# Altium schematic sheet Connector B.SchDoc
size A4; SheetNumber: 13; SheetTotal: 16
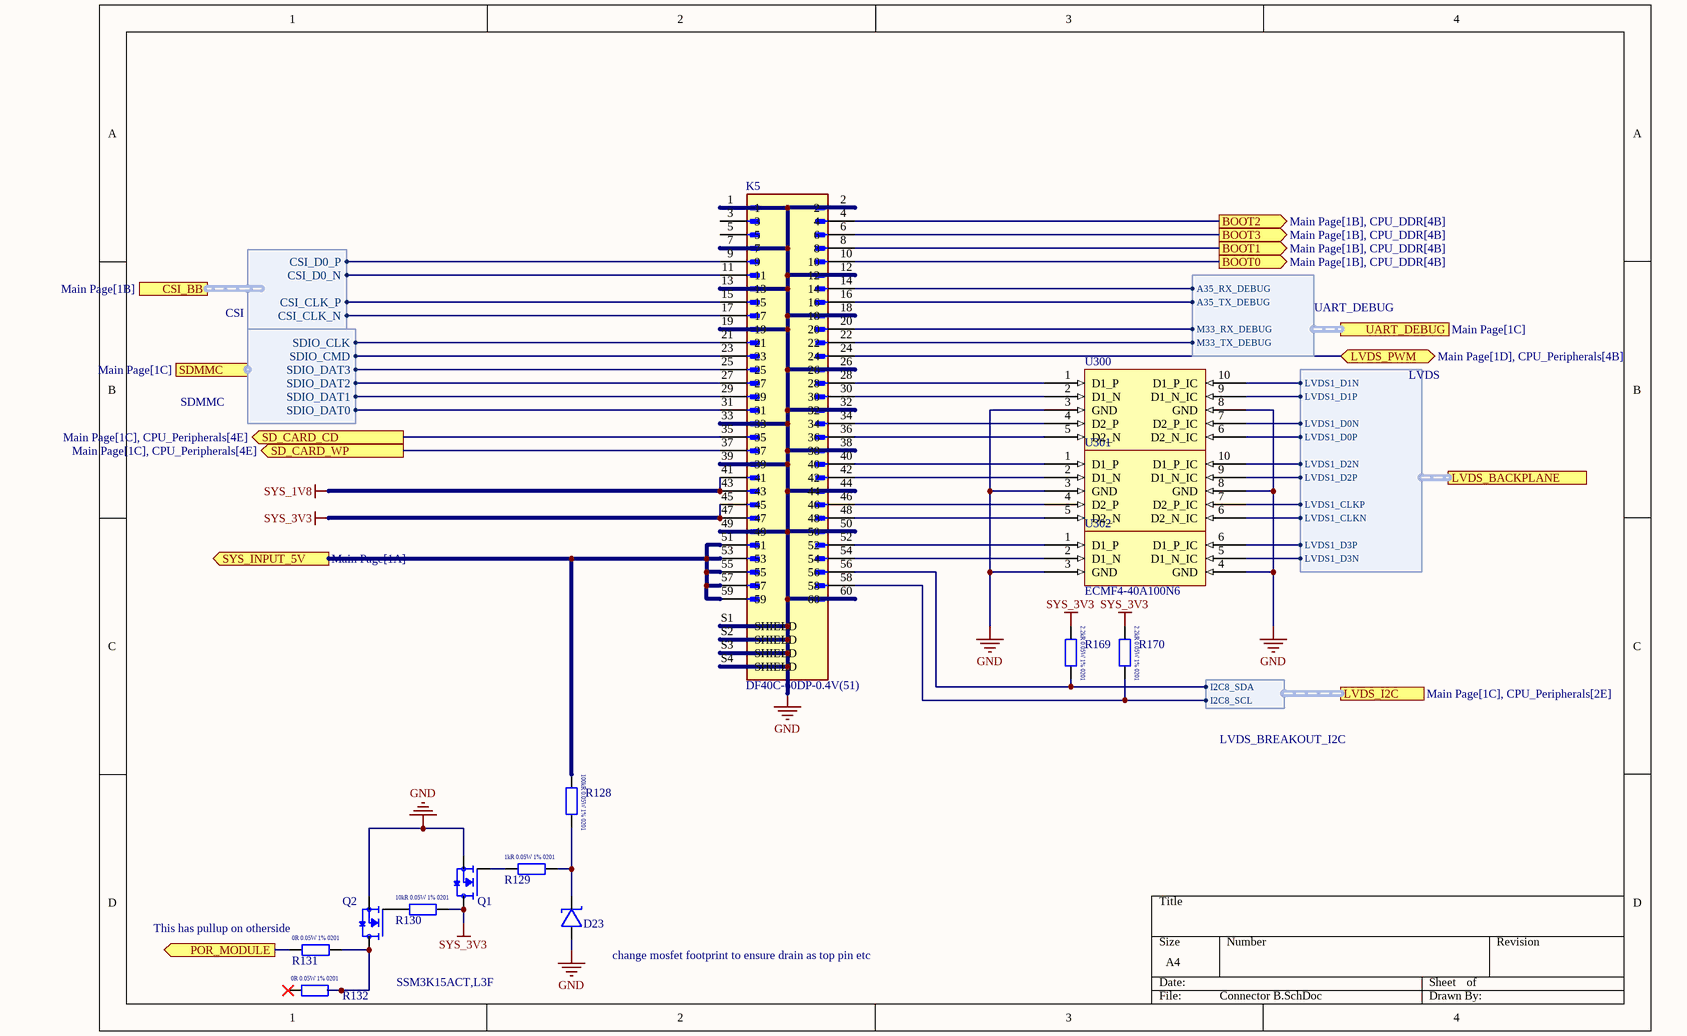
[diagram p0: Connector B.SchDoc]

## Parts
D23  RCLAMP04041PW.C  [RCLAMP04041PW.C]  (value not drawn)
K5  DF40C-60DP-0.4V(51)  [HIROSE_DF40C-60DP-0.4V(51)]
Q1  SSM3K15ACT,L3F  [SSM3K15ACT]
Q2  SSM3K15ACT,L3F  [SSM3K15ACT]  (value not drawn)
R128  ERJ-1GNF1003C  [RESC0603X03L]  (value not drawn)
R129  ERJ-1GNF1001C  [RESC0603X03L]  (value not drawn)
R130  ERJ-1GNF1002C  [RESC0603X03L]  (value not drawn)
R131  ERJ-1GN0R00C  [RESC0603X03L]  (value not drawn)
R132  ERJ-1GN0R00C  [RESC0603X03L]  (value not drawn)
R169  RC0201FR-072K2L  [RESC0603X03L]  (value not drawn)
R170  RC0201FR-072K2L  [RESC0603X03L]  (value not drawn)
U300  ECMF4-40A100N10  [ECMF4-40A100N10]
U301  ECMF4-40A100N10  [ECMF4-40A100N10]
U302  ECMF4-40A100N6  [ECMF2-40A100N6]

## Ports
BOOT0 (out, see Main Page[1B], CPU_DDR[4B]), BOOT1 (out, see Main Page[1B], CPU_DDR[4B]), BOOT2 (out, see Main Page[1B], CPU_DDR[4B]), BOOT3 (out, see Main Page[1B], CPU_DDR[4B]), CSI_BB (harness CSI, see Main Page[1B]), LVDS_BACKPLANE (harness LVDS, see Main Page[1A]), LVDS_I2C (harness LVDS_BREAKOUT_I2C, see Main Page[1C], CPU_Peripherals[2E]), LVDS_PWM (bidir, see Main Page[1D], CPU_Peripherals[4B]), POR_MODULE (out, see Main Page[1A], CPU_DDR[4B], Power Management[3F]), SD_CARD_CD (out, see Main Page[1C], CPU_Peripherals[4E]), SD_CARD_WP (out, see Main Page[1C], CPU_Peripherals[4E]), SDMMC (harness SDMMC, see Main Page[1C]), SYS_INPUT_5V (out, see Main Page[1A]), UART_DEBUG (harness UART_DEBUG, see Main Page[1C])

## Harnesses
SDMMC: SDIO_CLK, SDIO_CMD, SDIO_DAT0, SDIO_DAT1, SDIO_DAT2, SDIO_DAT3
UART_DEBUG: A35_RX_DEBUG, A35_TX_DEBUG, M33_RX_DEBUG, M33_TX_DEBUG
LVDS: LVDS1_CLKN, LVDS1_CLKP, LVDS1_D0N, LVDS1_D0P, LVDS1_D1N, LVDS1_D1P, LVDS1_D2N, LVDS1_D2P, LVDS1_D3N, LVDS1_D3P
LVDS_BREAKOUT_I2C: I2C8_SCL, I2C8_SDA
CSI: CSI_CLK_N, CSI_CLK_P, CSI_D0_N, CSI_D0_P

## Nets
GND: D23.1 K5.1 K5.2 K5.7 K5.12 K5.13 K5.18 K5.19 K5.26 K5.32 K5.33 K5.38 K5.39 K5.44 K5.49 K5.50 K5.60 K5.S1(SHIELD) K5.S2(SHIELD) K5.S3(SHIELD) K5.S4(SHIELD) Q1.3(S) Q2.3(S) U300.3(GND) U300.8(GND) U301.3(GND) U301.8(GND) U302.3(GND) U302.4(GND)
SYS_1V8: K5.41 K5.43
SYS_3V3: K5.45 K5.47 Q1.2(D) R130.2 R169.1 R170.1
BOOT0: K5.10 ; port BOOT0
BOOT1: K5.8 ; port BOOT1
BOOT2: K5.4 ; port BOOT2
BOOT3: K5.6 ; port BOOT3
LVDS_PWM: K5.24 ; port LVDS_PWM
POR_MODULE: R131.1 ; port POR_MODULE
SD_CARD_CD: K5.35 ; port SD_CARD_CD
SD_CARD_WP: K5.37 ; port SD_CARD_WP
SYS_INPUT_5V: K5.51 K5.53 K5.55 K5.57 K5.59 R128.1 ; port SYS_INPUT_5V
NetD23_2: D23.2 R128.2 R129.2
NetK5_9: K5.9 ; port CSI_BB.CSI_D0_P
NetK5_11: K5.11 ; port CSI_BB.CSI_D0_N
NetK5_14: K5.14 ; port UART_DEBUG.A35_RX_DEBUG
NetK5_15: K5.15 ; port CSI_BB.CSI_CLK_P
NetK5_16: K5.16 ; port UART_DEBUG.A35_TX_DEBUG
NetK5_17: K5.17 ; port CSI_BB.CSI_CLK_N
NetK5_20: K5.20 ; port UART_DEBUG.M33_RX_DEBUG
NetK5_21: K5.21 ; port SDMMC.SDIO_CLK
NetK5_22: K5.22 ; port UART_DEBUG.M33_TX_DEBUG
NetK5_23: K5.23 ; port SDMMC.SDIO_CMD
NetK5_25: K5.25 ; port SDMMC.SDIO_DAT3
NetK5_27: K5.27 ; port SDMMC.SDIO_DAT2
NetK5_28: K5.28 U300.1(D1_P)
NetK5_29: K5.29 ; port SDMMC.SDIO_DAT1
NetK5_30: K5.30 U300.2(D1_N)
NetK5_31: K5.31 ; port SDMMC.SDIO_DAT0
NetK5_34: K5.34 U300.4(D2_P)
NetK5_36: K5.36 U300.5(D2_N)
NetK5_40: K5.40 U301.1(D1_P)
NetK5_42: K5.42 U301.2(D1_N)
NetK5_46: K5.46 U301.4(D2_P)
NetK5_48: K5.48 U301.5(D2_N)
NetK5_52: K5.52 U302.1(D1_P)
NetK5_54: K5.54 U302.2(D1_N)
NetK5_56: K5.56 R169.2 ; port LVDS_I2C.I2C8_SDA
NetK5_58: K5.58 R170.2 ; port LVDS_I2C.I2C8_SCL
NetQ1_1: Q1.1(G) R129.1
NetQ2_1: Q2.1(G) R130.1
NetQ2_2: Q2.2(D) R131.2 R132.2
NetU300_6: U300.6(D2_N_IC) ; port LVDS_BACKPLANE.LVDS1_D0P
NetU300_7: U300.7(D2_P_IC) ; port LVDS_BACKPLANE.LVDS1_D0N
NetU300_9: U300.9(D1_N_IC) ; port LVDS_BACKPLANE.LVDS1_D1P
NetU300_10: U300.10(D1_P_IC) ; port LVDS_BACKPLANE.LVDS1_D1N
NetU301_6: U301.6(D2_N_IC) ; port LVDS_BACKPLANE.LVDS1_CLKN
NetU301_7: U301.7(D2_P_IC) ; port LVDS_BACKPLANE.LVDS1_CLKP
NetU301_9: U301.9(D1_N_IC) ; port LVDS_BACKPLANE.LVDS1_D2P
NetU301_10: U301.10(D1_P_IC) ; port LVDS_BACKPLANE.LVDS1_D2N
NetU302_5: U302.5(D1_N_IC) ; port LVDS_BACKPLANE.LVDS1_D3N
NetU302_6: U302.6(D1_P_IC) ; port LVDS_BACKPLANE.LVDS1_D3P

Not connected (* = marked no-connect by the designer): K5 3 5; R132 1*

## Notes on the sheet
- (near R131) This has pullup on otherside
- (near D23) change mosfet footprint to ensure drain as top pin etc
- (in symbol ERJ-1GN0R00C) 0R 0.05W 1% 0201
- (in symbol ERJ-1GNF1001C) 1kR 0.05W 1% 0201
- (in symbol ERJ-1GNF1002C) 10kR 0.05W 1% 0201
- (in symbol ERJ-1GNF1003C) 100kR 0.05W 1% 0201
- (in symbol RC0201FR-072K2L) 2.2kR 0.05W 1% 0201

## Library data of the parts
D23 = RCLAMP04041PW.C: 8V Clamp 20A (8/20µs) Ipp Tvs Diode Surface Mount 2-DFN (1x0.6); ComponentLink1Description: New link; ComponentLink1URL: https://www.digikey.com.au/en/products/detail/semtech-corporation/RCLAMP04041PW-C/21379403
K5 = DF40C-60DP-0.4V(51): 60 Position Connector Plug, Outer Shroud Contacts Surface Mount Gold; MF: Hirose Electric; Value: *; Purchase-URL: https://pricing.snapeda.com/search/part/DF40C-60DP-0.4V(51)/?ref=eda; MP: DF40C-60DP-0.4V(51); Price: None; Package: None; Availability: In Stock; SnapEDA_Link: https://www.snapeda.com/parts/DF40C-60DP-0.4V(51)/Hirose+Electric+Co+Ltd/view-part/?ref=snap; Check_prices: https://www.snapeda.com/parts/DF40C-60DP-0.4V(51)/Hirose+Electric+Co+Ltd/view-part/?ref=eda
Q1 Q2 = SSM3K15ACT,L3F: N-Channel 30 V 100mA (Ta) 100mW (Ta) Surface Mount CST3; ComponentLink1Description: New link; ComponentLink1URL: https://www.digikey.com.au/en/products/detail/toshiba-semiconductor-and-storage/SSM3K15ACT-L3F/5298026
R128 = ERJ-1GNF1003C: 100 kOhms ±1% 0.05W, 1/20W Chip Resistor 0201 (0603 Metric) Thick Film; ComponentLink1Description: New link; ComponentLink1URL: https://www.digikey.com.au/en/products/detail/panasonic-electronic-components/ERJ-1GNF1003C/2036340
R129 = ERJ-1GNF1001C: 1 kOhms ±1% 0.05W, 1/20W Chip Resistor 0201 (0603 Metric) Thick Film
R130 = ERJ-1GNF1002C: 10 kOhms ±1% 0.05W, 1/20W Chip Resistor 0201 (0603 Metric) Thick Film; ComponentLink1Description: New link; ComponentLink1URL: https://www.digikey.com.au/en/products/detail/panasonic-electronic-components/ERJ-1GNF1002C/2036226
R131 R132 = ERJ-1GN0R00C: 0 Ohms Jumper Chip Resistor 0201 (0603 Metric) Thick Film; ComponentLink1Description: New link; ComponentLink1URL: https://www.digikey.com.au/en/products/detail/panasonic-electronic-components/ERJ-1GN0R00C/3982613
R169 R170 = RC0201FR-072K2L: 2.2 kOhms ±1% 0.05W, 1/20W Chip Resistor 0201 (0603 Metric) Moisture Resistant Thick Film
U300 U301 = ECMF4-40A100N10: 4 Line Common Mode Choke Surface Mount 100mA DCR 3Ohm (Typ); ComponentLink1Description: New link; ComponentLink1URL: https://www.digikey.com/en/products/detail/stmicroelectronics/ECMF4-40A100N10/16379603
U302 = ECMF4-40A100N6: 2 Line Common Mode Choke Surface Mount 100mA DCR 3Ohm (Typ)